# Altium schematic sheet MCLR_PIC.SchDoc
size A4; SheetNumber: 6; SheetTotal: 11
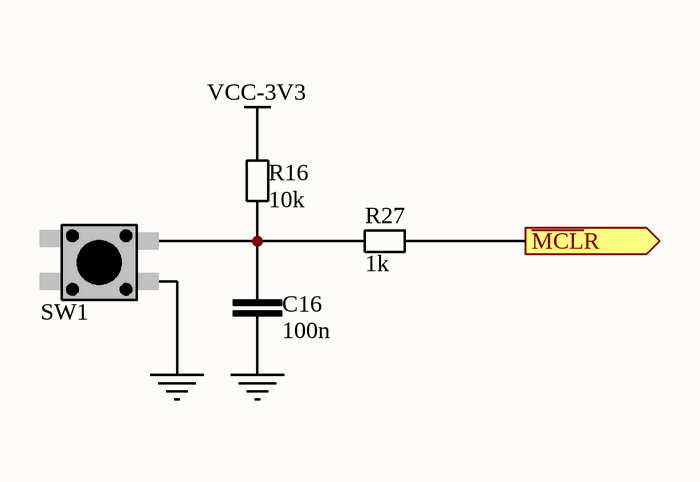
[diagram p0: MCLR_PIC.SchDoc]

## Parts
C16  100n  [CER_0603]
R16  10k  [RESC2013X38N-0805-NOOVERLAY]
R27  1k  [RESC2013X38N-0805-NOOVERLAY]
SW1  TASTER  [TASTER_SMD]  (value not drawn)

## Ports
~{MCL}R (out)

## Nets
GND: C16.1 SW1.1
VCC-3V3: R16.2
~{MCL}R: R27.2 ; port ~{MCL}R
NetC16_2: C16.2 R16.1 R27.1 SW1.2

## Notes on the sheet
- Title
- Date:
- Design Engineer:
- Time:
- Revision:
- Sheet
- of
- Size:
- A4
- www.memristor-robotics.io
- File:

## Library data of the parts
C16 = 06032105: CAP CER 100n 10V X5R 10% 0603; Capacitance: 100n
R16 = 000001002: RES SMD 10 kOhm 1/8W 0805; Resistance: 10k
R27 = 00001001: RES SMD 1 kOhm 1/8W 0805; Power: 0.125W, 1/8W; Barcode: 00009101; Resistance: 1k; Assembly: SMD